# EAGLE schematic Schematic (EAGLE 9.1.3)
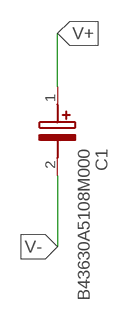
[diagram p0: schematic, sheet 1]

## Parts
C1  B43630A5108M000  [CAPPRD1000W170D3500H5500]

## Nets
V+: C1.1(+)
V-: C1.2(-)

## Library data of the parts
C1 = B43630A5108M000:B43630A5108M000: EPCOS - B43630A5108M000 - CAP, 1000F, 450V, ALU ELEC, SNAP-IN Source: Datasheet <https://www.mouser.com/datasheet/2/400/B43630-1528053.pdf>; ARROW_PART_NUMBER: B43630A5108M000; DESCRIPTION: EPCOS - B43630A5108M000 - CAP, 1000F, 450V, ALU ELEC, SNAP-IN; HEIGHT: 55mm; MANUFACTURER_NAME: EPCOS; MANUFACTURER_PART_NUMBER: B43630A5108M000; MOUSER_PART_NUMBER: 871-B43630A5108M000; MOUSER_PRICE-STOCK: https://www.mouser.co.uk/ProductDetail/EPCOS-TDK/B43630A5108M000?qs=GG15fDrrStr2jMk4txCBNQ%3D%3D